# EAGLE schematic HW1_Justin Ngo_u0453732_MotorPCB (EAGLE 7.7.0)
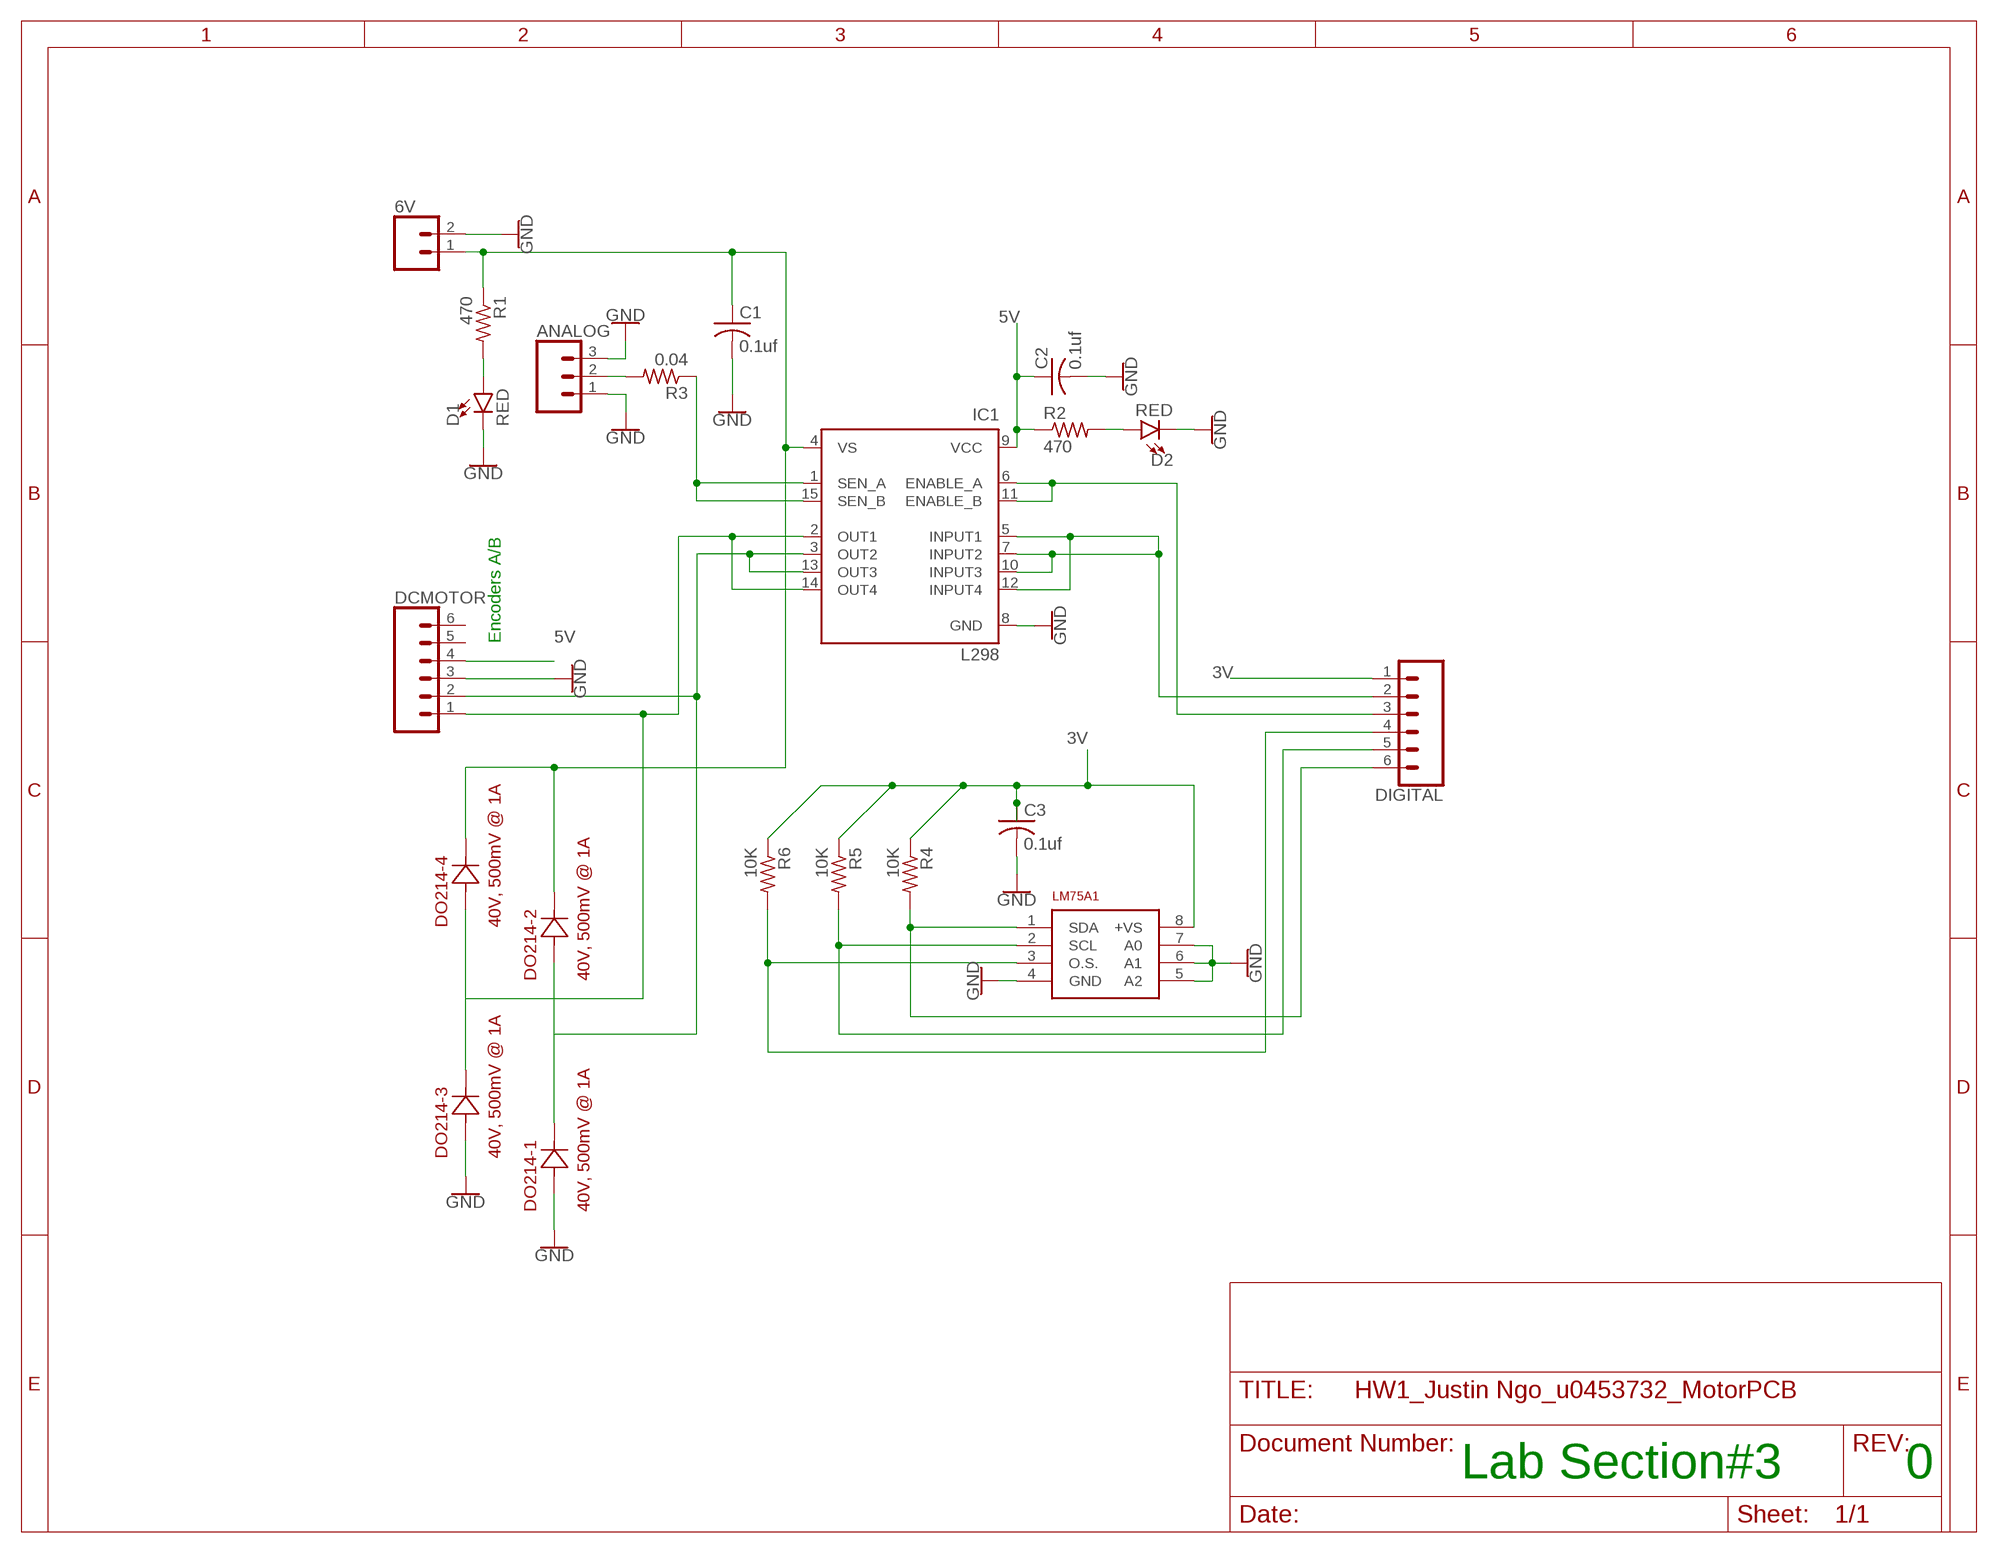
[diagram p0: schematic, sheet 1]

## Parts
6V  CONN_025MM  [SCREWTERMINAL-5MM-2]
ANALOG  CONN_03  [1X03]
C1  0.1uf  C-USC1206  [C1206]
C2  0.1uf  C-USC1206  [C1206]
C3  0.1uf  C-USC1206  [C1206]
D1  RED  LED-RED1206  [LED-1206]
D2  RED  LED-RED1206  [LED-1206]
DCMOTOR  CONN_06LOCK_LONGPADS  [1X06_LOCK_LONGPADS]
DIGITAL  CONN_06LOCK_LONGPADS  [1X06_LOCK_LONGPADS]
DO214-1  40V, 500mV @ 1A  SS14  [DIODE_DO214AC]
DO214-2  40V, 500mV @ 1A  SS14  [DIODE_DO214AC]
DO214-3  40V, 500mV @ 1A  SS14  [DIODE_DO214AC]
DO214-4  40V, 500mV @ 1A  SS14  [DIODE_DO214AC]
IC1  L298  [MULTIWATT-15]
LM75A1  TI-LM75A  [TI-LM75A]
R1  470  R-US_R1206  [R1206]
R2  470  R-US_R1206  [R1206]
R3  0.04  R-US_R1206  [R1206]
R4  10K  R-US_R1206  [R1206]
R5  10K  R-US_R1206  [R1206]
R6  10K  R-US_R1206  [R1206]

## Nets
3V: C3.1 DIGITAL.1 LM75A1.8(+VS) R4.1 R5.1 R6.1
5V: C2.1 DCMOTOR.4 IC1.9(VCC) R2.1
GND: 6V.2 ANALOG.1 ANALOG.3 C1.2 C2.2 C3.2 D1.C D2.C DCMOTOR.3 DO214-1.2 DO214-3.2 IC1.8(GND) LM75A1.4(GND) LM75A1.5(A2) LM75A1.6(A1) LM75A1.7(A0)
N$1: D1.A R1.2
N$2: DIGITAL.6 LM75A1.1(SDA) R4.2
N$3: ANALOG.2 R3.2
N$4: DIGITAL.3 IC1.6(ENABLE_A) IC1.11(ENABLE_B)
N$5: IC1.1(SEN_A) IC1.15(SEN_B) R3.1
N$7: DIGITAL.5 LM75A1.2(SCL) R5.2
N$8: DIGITAL.4 LM75A1.3(O.S.) R6.2
N$9: DIGITAL.2 IC1.5(INPUT1) IC1.7(INPUT2) IC1.10(INPUT3) IC1.12(INPUT4)
N$10: DCMOTOR.2 DO214-1.1 DO214-2.2 IC1.3(OUT2) IC1.13(OUT3)
N$12: DCMOTOR.1 DO214-3.1 DO214-4.2 IC1.2(OUT1) IC1.14(OUT4)
N$13: 6V.1 C1.1 DO214-2.1 DO214-4.1 IC1.4(VS) R1.1
N$15: D2.A R2.2
Unconnected: DCMOTOR.5 DCMOTOR.6

## Notes on the sheet
- Encoders A/B
- Lab Section#3 | 0

## Library data of the parts
6V = SparkFun-Connectors:CONN_02: Multi connection point. Often used as Generic Header-pin footprint for 0.1 inch spaced/style header connections On any of the 0.1 inch spaced packages, you can populate with these: Break Away Headers - Straight <https://www.sparkfun.com/products/116> (PRT-00116) Break Away Male Headers - Right Angle <https://www.sparkfun.com/products/553> (PRT-00553) Female Headers <https://www.sparkfun.com/products/115> (PRT-00115) Break Away Headers - Machine Pin <https://www.sparkfun.com/products/117> (PRT-00117) Break Away Female Headers - Swiss Machine Pin <https://www.sparkfun.com/products/743> (PRT-00743) For SCREWTERMINALS and SPRING TERMINALS visit here: Screw Terimnals on SparkFun.com <https://www.sparkfun.com/search/results?term=Screw+Terminals> (5mm/3.5mm/2.54mm spacing) This device is also useful as a general connection point to wire up your design to another part of your project. Our various solder wires solder well into these plated through hole pads. Hook-Up Wire - Assortment (Stranded, 22 AWG) <https://www.sparkfun.com/products/11375> (PRT-11375) Hook-Up Wire - Assortment (Solid Core, 22 AWG) <https://www.sparkfun.com/products/11367> (PRT-11367) View the entire wire category on our website here <https://www.sparkfun.com/categories/141> Special notes: Molex polarized connector foot print use with: PRT-08233 with associated crimp pins and housings. 2.54_SCREWTERM for use with PRT-10571. 3.5mm Screw Terminal footprints for PRT-08084 5mm Screw Terminal footprints for use with PRT-08432; SF_SKU: PRT-08432
ANALOG = SparkFun-Connectors:CONN_03: Multi connection point. Often used as Generic Header-pin footprint for 0.1 inch spaced/style header connections On any of the 0.1 inch spaced packages, you can populate with these: Break Away Headers - Straight <https://www.sparkfun.com/products/116> (PRT-00116) Break Away Male Headers - Right Angle <https://www.sparkfun.com/products/553> (PRT-00553) Female Headers <https://www.sparkfun.com/products/115> (PRT-00115) Break Away Headers - Machine Pin <https://www.sparkfun.com/products/117> (PRT-00117) Break Away Female Headers - Swiss Machine Pin <https://www.sparkfun.com/products/743> (PRT-00743) Stackable Header - 3 Pin (Female, 0.1") <https://www.sparkfun.com/products/13875> (PRT-13875) For SCREWTERMINALS and SPRING TERMINALS visit here: Screw Terimnals on SparkFun.com <https://www.sparkfun.com/search/results?term=Screw+Terminals> (5mm/3.5mm/2.54mm spacing) This device is also useful as a general connection point to wire up your design to another part of your project. Our various solder wires solder well into these plated through hole pads. Hook-Up Wire - Assortment (Stranded, 22 AWG) <https://www.sparkfun.com/products/11375> (PRT-11375) Hook-Up Wire - Assortment (Solid Core, 22 AWG) <https://www.sparkfun.com/products/11367> (PRT-11367) View the entire wire category on our website here <https://www.sparkfun.com/categories/141> Special notes: Molex polarized connector foot print use with SKU : PRT-08232 with associated crimp pins and housings.
C1-C3 = rcl:C-US: CAPACITOR, American symbol
D1 D2 = SparkFun-LED:LED-RED: Red SMD LED Used in manufacturing of most products at SparkFun Packages: 0603 - SMD 0603 package [Product Link] <http://docs.avagotech.com/docs/AV02-0551EN> 0603 SMART - SMD 0603 SMART package ( more efficient and expensive)[Product Link] <http://www.osram-os.com/Graphics/XPic2/00077099_0.pdf> 1206 - SMD1206 package [Product Link] <https://www.sparkfun.com/datasheets/DevTools/LilyPad/Q150OVS4.pdff> SparkFun Products: Pro Mini 328 -5V <https://www.sparkfun.com/products/821> RedBoard <https://www.sparkfun.com/products/12757> IOIO-OTG <https://www.sparkfun.com/products/13613>; PROD_ID: DIO-09912
DCMOTOR DIGITAL = SparkFun-Connectors:CONN_06: Multi connection point. Often used as Generic Header-pin footprint for 0.1 inch spaced/style header connections On any of the 0.1 inch spaced packages, you can populate with these: Break Away Headers - Straight <https://www.sparkfun.com/products/116> (PRT-00116) Break Away Male Headers - Right Angle <https://www.sparkfun.com/products/553> (PRT-00553) Female Headers <https://www.sparkfun.com/products/115> (PRT-00115) Break Away Headers - Machine Pin <https://www.sparkfun.com/products/117> (PRT-00117) Break Away Female Headers - Swiss Machine Pin <https://www.sparkfun.com/products/743> (PRT-00743) Arduino Stackable Header - 6 Pin <https://www.sparkfun.com/products/9280> (PRT-09280) For SCREWTERMINALS and SPRING TERMINALS visit here: Screw Terimnals on SparkFun.com <https://www.sparkfun.com/search/results?term=Screw+Terminals> (5mm/3.5mm/2.54mm spacing) This device is also useful as a general connection point to wire up your design to another part of your project. Our various solder wires solder well into these plated through hole pads. Hook-Up Wire - Assortment (Stranded, 22 AWG) <https://www.sparkfun.com/products/11375> (PRT-11375) Hook-Up Wire - Assortment (Solid Core, 22 AWG) <https://www.sparkfun.com/products/11367> (PRT-11367) View the entire wire category on our website here <https://www.sparkfun.com/categories/141>
DO214-1-DO214-4 = Ngo2:SS14; COPYRIGHT: Copyright C 2015 Accelerated Designs. All rights reserved; DESCRIPTION: Schottky barrier diodeSS14 1A 40V; FAMILY: Rectifier; MANUFACTURER_NAME: Vishay; MANUFACTURER_PART_NUMBER: SS14; RSPARTNUMBER: 4470352; SECTION: Discretes; SUPERSECTION: Semiconductors; VENDOR: Vishay
IC1 = st-microelectronics:L298: DUAL FULL-BRIDGE DRIVER; MPN: L298N; OC_FARNELL: 1589425; OC_NEWARK: 32M1527
LM75A1 = Ngo:TI-LM75A
R1-R6 = rcl:R-US_: RESISTOR, American symbol